# Altium schematic sheet Flash.SchDoc: Flash Memory
size A; Date: Not used; ApprovedBy: Not used; CheckedBy: Not used; Author: Not used; CompanyName: STMicroelectronics; DrawnBy: Not used; Engineer: Not used; Organization: Not used; Address1: Not used; Address2: Not used; Address3: Not used; Address4: Not used; DocumentNumber: Not used; Revision: 1.0.0; SheetNumber: 5; SheetTotal: 6; CurrentTime: Not used; CurrentDate: Not used; Time: Not used; DocumentFullPathAndName: Not used; DocumentName: Not used; ModifiedDate: Not used; ImagePath: Not used; ProjectName: Not used; Application_BuildNumber: Not used
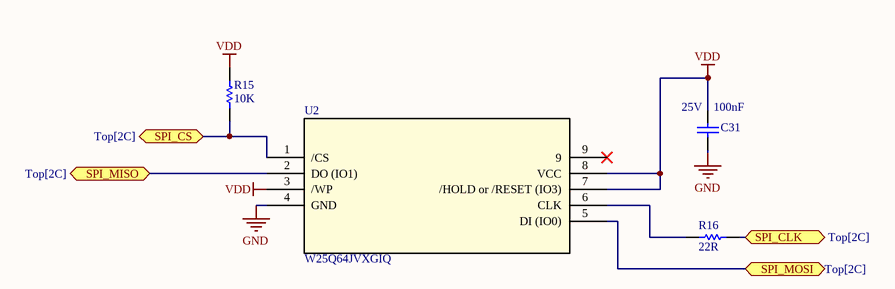
[diagram p0: Flash.SchDoc]

## Parts
C31  value 100nF  Voltage Rating (DC): 25V  [C0402]  (hidden comment: Capacitor)
R15  value 10K  [R0402]  (hidden comment: Resistor)
R16  value 22R  [R0402]  (hidden comment: Resistor)
U2  W25Q64JVXGIQ  [DFN_XGIQ TR_WIN-L]

## Ports
SPI_CLK (bidir, see Top[2C]), SPI_CS (bidir, see Top[2C]), SPI_MISO (bidir, see Top[2C]), SPI_MOSI (bidir, see Top[2C])

## Nets
GND: C31.1 U2.4(GND)
VDD: C31.2 R15.2 U2.3(/WP) U2.7(/HOLD_or_/RESET_(IO3)) U2.8(VCC)
SPI_CLK: R16.1 ; port SPI_CLK
SPI_CS: R15.1 U2.1(/CS) ; port SPI_CS
SPI_MISO: U2.2(DO_(IO1)) ; port SPI_MISO
SPI_MOSI: U2.5(DI_(IO0)) ; port SPI_MOSI
NetR16_2: R16.2 U2.6(CLK)

Not connected (* = marked no-connect by the designer): U2 9*

## Notes on the sheet
- Title:
- Size:
- Date:
- A
- Revision:
- Sheet
- of
- File:

## Library data of the parts
C31 = MCD-02774: Multilayer Ceramic Capacitors MLCC - SMD/SMT 0402 0.10uF 25volt X5R +/-10%; Manufacturer: Murata; Manufacturer Part Number: GRM155R61E104KA87D; Tolerance: 10%; ComponentLink1URL: http://tunmcdsvn.tun.st.com/Component_Documentation_Library/Trunk/Capacitor/TDK_CGA_Series; Supplier 1: Digi-Key; Supplier Part Number 1: 490-5920-1-ND; RoHS: Yes; Category: Ceramic Capacitors; Stock 1: 4700358; Pricing 1: 1=0.1, 10=0.047, 50=0.0272, 100=0.0211, 500=0.0159, 1000=0.0125, 2500=0.01136, 5000=0.01045 (USD); Case/Package: 0402; Case Code (Metric): 1005; Case Code (Imperial): 0402; Weight: 0.000388oz; Min Operating Temperature: -55°C; Max Operating Temperature: 85°C; Packaging: Cut Tape; Package Quantity: 10000; Dielectric: X5R; Termination: Standard; Series: GRM; Length: 1mm; Width: 0.5mm; Height: 0.5mm; RoHS Compliant: Yes; Lead Free: 5697LeadFree; ComponentLink2URL: https://datasheet.ciiva.com/11618/product-11618757.pdf?src-supplier=Avnet; ComponentLink2Description: https://datasheet.ciiva.com/11618/product-11618757.pdf?src-supplier=Avnet; ComponentLink3URL: https://datasheet.ciiva.com/29199/454084-da-01-en-vs-kondensator-0402-29199796.pdf?src-supplier=Conrad; ComponentLink3Description: https://datasheet.ciiva.com/29199/454084-da-01-en-vs-kondensator-0402-29199796.pdf?src-supplier=Conrad; ComponentLink4URL: https://datasheet.ciiva.com/6270/partnumbering-e-01-6270936.pdf?src-supplier=Digi-Key; ComponentLink4Description: https://datasheet.ciiva.com/6270/partnumbering-e-01-6270936.pdf?src-supplier=Digi-Key; ComponentLink5URL: https://datasheet.ciiva.com/6270/partnumbering-e-01-6270934.pdf?src-supplier=Digi-Key; ComponentLink5Description: https://datasheet.ciiva.com/6270/partnumbering-e-01-6270934.pdf?src-supplier=Digi-Key; ComponentLink6URL: https://datasheet.ciiva.com/6270/partnumbering-e-01-6270938.pdf?src-supplier=Digi-Key; ComponentLink6Description: https://datasheet.ciiva.com/6270/partnumbering-e-01-6270938.pdf?src-supplier=Digi-Key; ComponentLink7URL: https://datasheet.ciiva.com/16467/product-16467303.pdf?src-supplier=Future+Electronics; ComponentLink7Description: https://datasheet.ciiva.com/16467/product-16467303.pdf?src-supplier=Future+Electronics
R15 = MCD-02551: Resistor, 10K, 0402, +/-0.1%, 1/16W, +/-25ppm/°C; Part_Preference: Recommended; Manufacturer: YAGEO; Manufacturer_Part_Number: RT0402BRD0710KL; Order_Code_RS: 1991270; ShowFields: YES; ID: 4657; Internal_Part_Number: MCD-02551; Status: Checked; Part_Type: Resistor; Package: 0402; ComponentLink1URL: http://tunmcdsvn.tun.st.com/Component_Documentation_Library/Trunk/Resistor/YAGEO_RT_Series; Order_Code_Digikey: YAG1346TR-ND; Order_Code_Farnell: 3496450RL; Manufacturer Part Number: RT0402BRD0710KL
R16 = MCD-00189: Resistor, 22R, 0402, +/-1%, 1/16W; Part_Preference: Recommended; Manufacturer: YAGEO; Manufacturer_Part_Number: RC0402FR-0722RL; Component_Country_Of_Origin: China; ShowFields: YES; ID: 2677; Internal_Part_Number: MCD-00189; Status: Released; Part_Type: Resistor; Package: 0402; ComponentLink1URL: http://tunmcdsvn.tun.st.com/Component_Documentation_Library/Trunk/Resistor/YAGEO_RC_L_Series; Order_Code_Digikey: 311-22.0LRCT-ND; Order_Code_Farnell: 9239030; Order_Code_RS: N/A; Manufacturer Part Number: RC0402FR-0722RL
U2 = W25Q64JVXGIQ TR: 64Mb Serial NOR Flash 133MHz XSON8; Mfr_Name: Winbond; Copyright: Copyright (C) 2023 Ultra Librarian. All rights reserved.; Manufacturer_Part_Number: W25Q64JVXGIQ TR; Digi-Key_Part_Number_1: 256-W25Q64JVXGIQTR-ND; RefDes: RefDes; Type: DEV; Manufacturer: Winbond; Manufacturer Part Number: W25Q64JVXGIQ TR